# Altium schematic sheet HT_Device.SchDoc
size A3; SheetNumber: 1; SheetTotal: 1
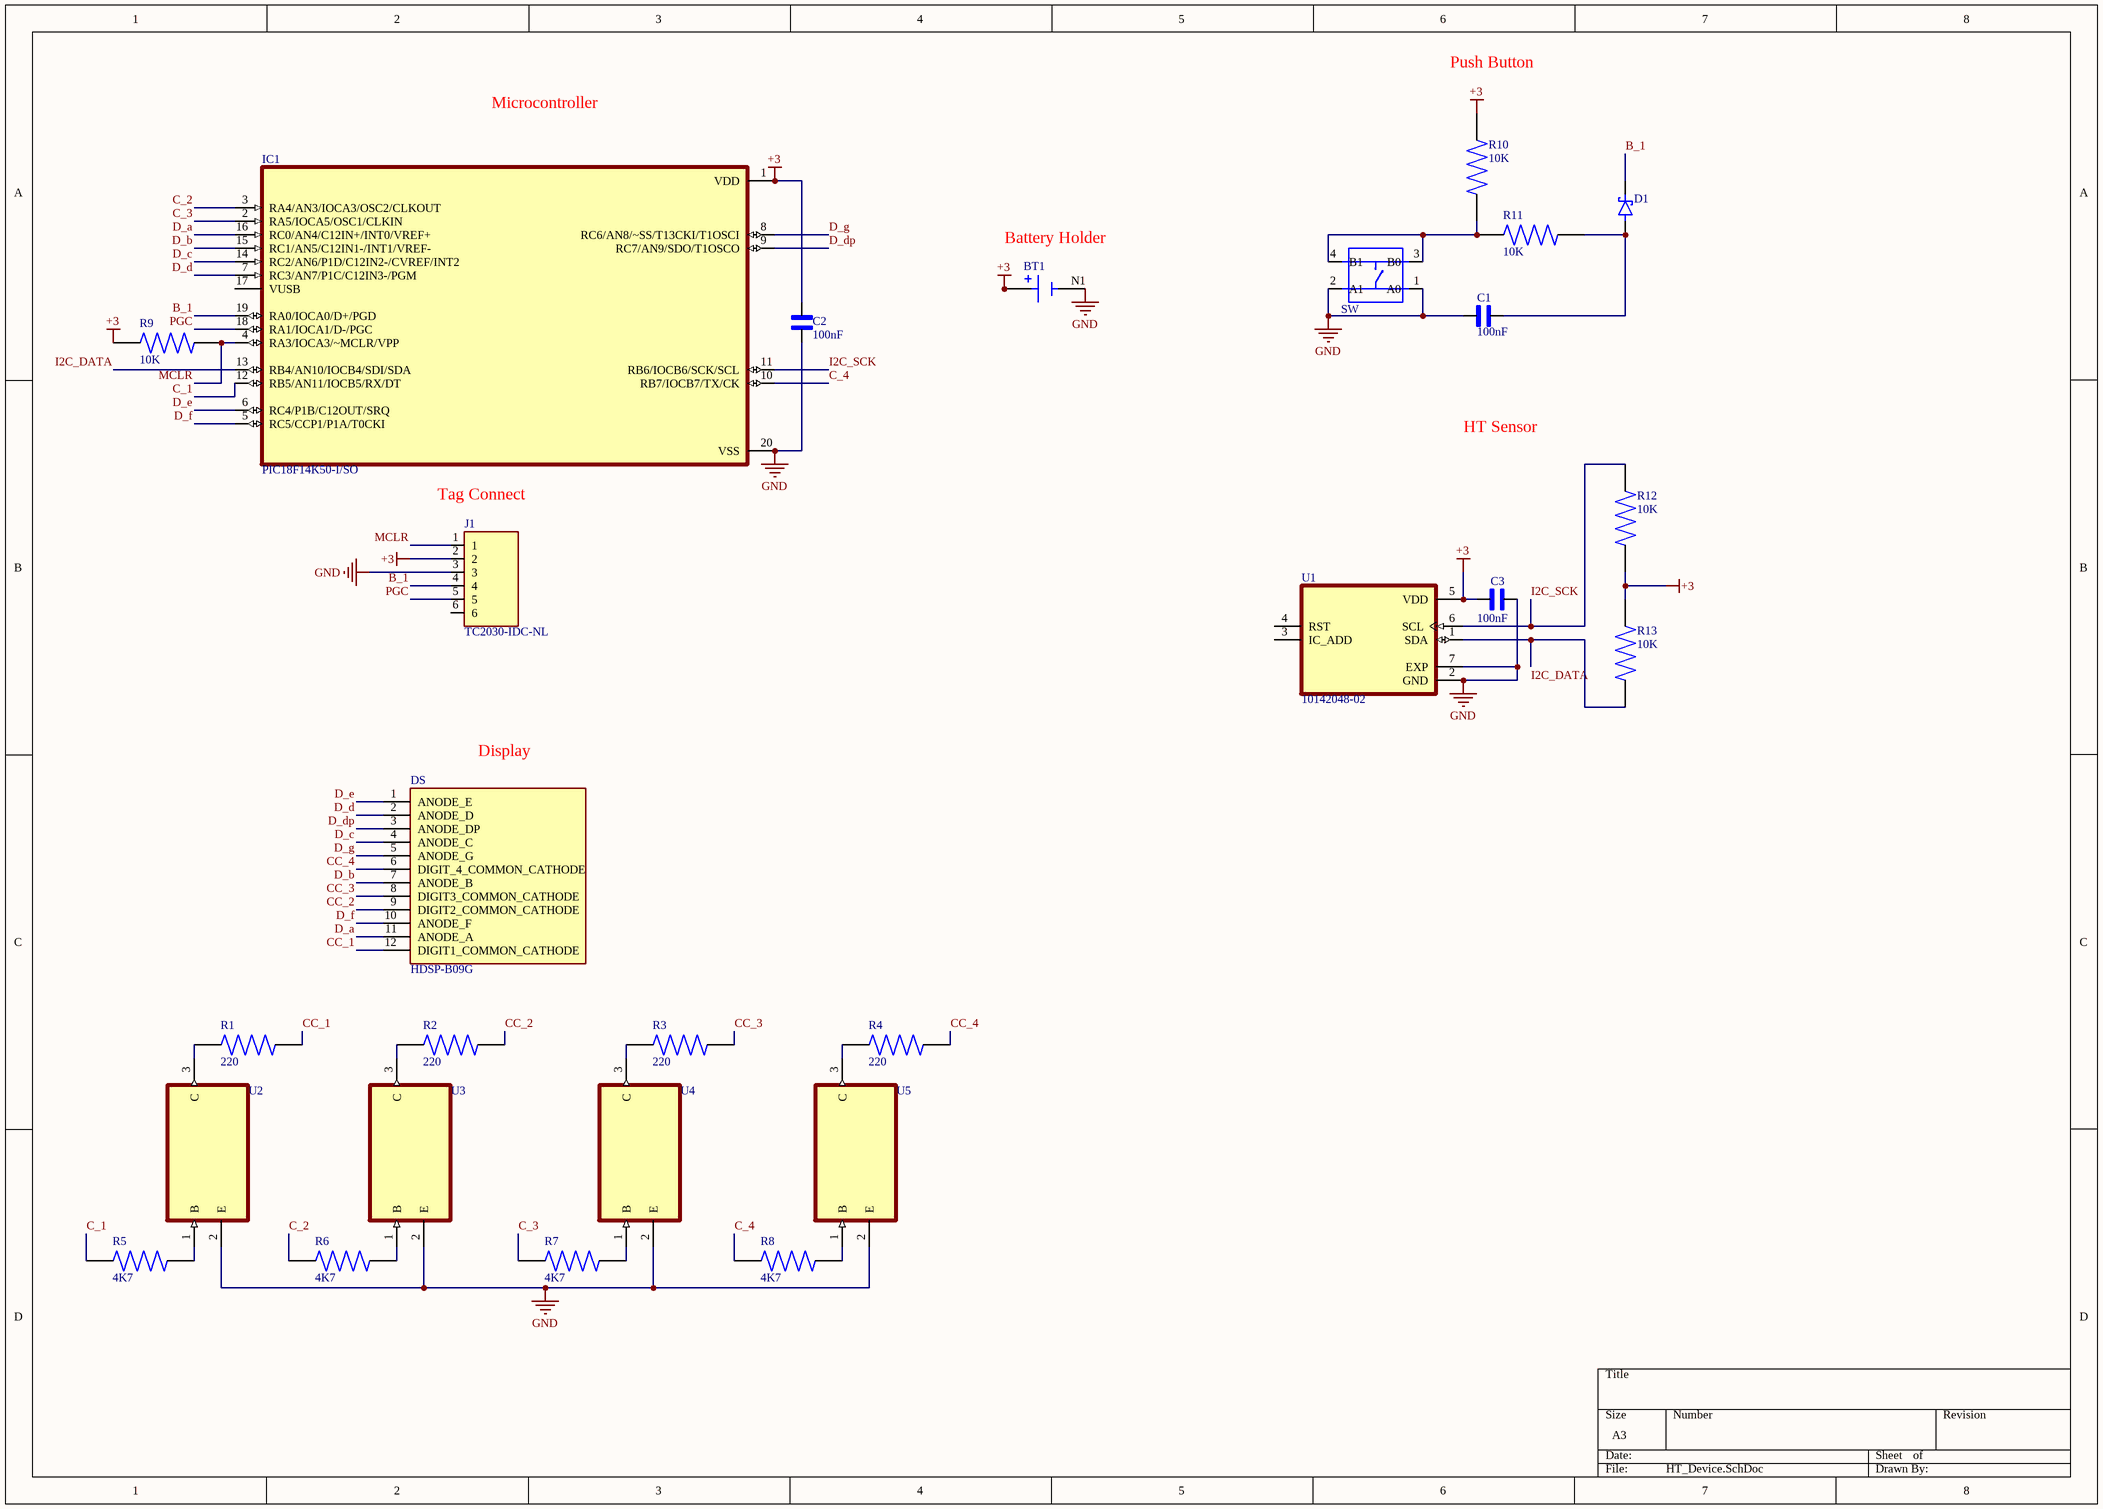
[diagram p0: HT_Device.SchDoc]

## Parts
BT1  BAT-HLD-001  [BAT_BAT-HLD-001]  (value not drawn)
C1  100nF  [WCAP-CSGP_885012207128]
C2  100nF  [WCAP-CSGP_885012207128]
C3  100nF  [WCAP-CSGP_885012207128]
D1  1N5817-T  [DIOAD1039W78L463D236]  (value not drawn)
DS  HDSP-B09G  [AVAGO_HDSP-B09G]
IC1  PIC18F14K50-I/SO  [SOIC127P1032X265-20N]
J1  TC2030-IDC-NL  [TAG_TC2030-IDC-NL]
R1  220  [RES_ERJP06J221V]
R2  220  [RES_ERJP06J221V]
R3  220  [RES_ERJP06J221V]
R4  220  [RES_ERJP06J221V]
R5  4K7  [RESC2012X55N]
R6  4K7  [RESC2012X55N]
R7  4K7  [RESC2012X55N]
R8  4K7  [RESC2012X55N]
R9  10K  [RESC2012X65N]
R10  10K  [RESC2012X65N]
R11  10K  [RESC2012X65N]
R12  10K  [RESC2012X65N]
R13  10K  [RESC2012X65N]
SW  SMD-BUTTON(4P-5.2X5.2X1.5MM-SKQGADE010)  [SW4-SMD-5.2X5.2X1.5MM]  (value not drawn)
U1  10142048-02  [SON80P250X250X100-7N_10142048-02]
U2  MMBT2222A-7-F  [SOT103P240X110-3N]  (value not drawn)
U3  MMBT2222A-7-F  [SOT103P240X110-3N]  (value not drawn)
U4  MMBT2222A-7-F  [SOT103P240X110-3N]  (value not drawn)
U5  MMBT2222A-7-F  [SOT103P240X110-3N]  (value not drawn)

## Nets
+3: BT1.P1(POS) BT1.P2(POS) C2.2 C3.2 IC1.1(VDD) J1.2 R9.1 R10.2 R12.1 R13.2 U1.5(VDD)
GND: BT1.N1(NEG) C1.2 C2.1 C3.1 IC1.20(VSS) J1.3 SW.1(A0) SW.2(A1) U1.2(GND) U1.7(EXP) U2.2(E) U3.2(E) U4.2(E) U5.2(E)
B_1: D1.1(K) IC1.19(RA0/IOCA0/D+/PGD) J1.4
C_1: IC1.12(RB5/AN11/IOCB5/RX/DT) R5.1
C_2: IC1.3(RA4/AN3/IOCA3/OSC2/CLKOUT) R6.1
C_3: IC1.2(RA5/IOCA5/OSC1/CLKIN) R7.1
C_4: IC1.10(RB7/IOCB7/TX/CK) R8.1
CC_1: DS.12(DIGIT1_COMMON_CATHODE) R1.2
CC_2: DS.9(DIGIT2_COMMON_CATHODE) R2.2
CC_3: DS.8(DIGIT3_COMMON_CATHODE) R3.2
CC_4: DS.6(DIGIT_4_COMMON_CATHODE) R4.2
D_a: DS.11(ANODE_A) IC1.16(RC0/AN4/C12IN+/INT0/VREF+)
D_b: DS.7(ANODE_B) IC1.15(RC1/AN5/C12IN1-/INT1/VREF-)
D_c: DS.4(ANODE_C) IC1.14(RC2/AN6/P1D/C12IN2-/CVREF/INT2)
D_d: DS.2(ANODE_D) IC1.7(RC3/AN7/P1C/C12IN3-/PGM)
D_dp: DS.3(ANODE_DP) IC1.9(RC7/AN9/SDO/T1OSCO)
D_e: DS.1(ANODE_E) IC1.6(RC4/P1B/C12OUT/SRQ)
D_f: DS.10(ANODE_F) IC1.5(RC5/CCP1/P1A/T0CKI)
D_g: DS.5(ANODE_G) IC1.8(RC6/AN8/~SS/T13CKI/T1OSCI)
I2C_DATA: IC1.13(RB4/AN10/IOCB4/SDI/SDA) R13.1 U1.1(SDA)
I2C_SCK: IC1.11(RB6/IOCB6/SCK/SCL) R12.2 U1.6(SCL)
MCLR: IC1.4(RA3/IOCA3/~MCLR/VPP) J1.1 R9.2
PGC: IC1.18(RA1/IOCA1/D-/PGC) J1.5
NetC1_1: C1.1 D1.2(A) R11.2
NetR1_1: R1.1 U2.3(C)
NetR2_1: R2.1 U3.3(C)
NetR3_1: R3.1 U4.3(C)
NetR4_1: R4.1 U5.3(C)
NetR5_2: R5.2 U2.1(B)
NetR6_2: R6.2 U3.1(B)
NetR7_2: R7.2 U4.1(B)
NetR8_2: R8.2 U5.1(B)
NetR10_1: R10.1 R11.1 SW.3(B0) SW.4(B1)

Not connected (* = marked no-connect by the designer): IC1 17(VUSB); J1 6; U1 3(IC_ADD) 4(RST)

## Notes on the sheet
- Microcontroller
- Push Button
- (near BT1) Battery Holder
- HT Sensor
- Tag Connect
- Display

## Library data of the parts
BT1 = BAT-HLD-001: Battery Retainer Coin, 20.0mm 1 Cell SMD (SMT) Tab; Value: *; MP: BAT-HLD-001; Package: None; Availability: Unavailable; Price: None
C1-C3 = 885012207128: <b> WCAP-CSGP Ceramic Capacitors <br> <br> <br><b>Characteristics </b><br> </b><br>Multilayer Ceramic Chip Capacitor <br>Recommended soldering:Reflow, for 0603 and 0805 wave soldering is also allowed <br>Operating temperature:-55 Â°C to +125 Â°C; <br>Ceramic characteristics: Class I - NPO ; Class II -X7R, X5R <br>High performance ceramic <br>High capacitance stability <br>Minimal aging  <br>Termination:Cu/Ni/Sn <br>   <br><a href="http://katalog.we-online.de/media/images/eisos/WCAP-CSGP_pf2.jpg" title="Enlarge picture"> <img src="http://katalog.we-online.de/media/thumbs2/eisos/thb_WCAP-CSGP_pf2.jpg" width="320"></a><p> Details see: <a href="http://katalog.we-online.de/en/pbs/WCAP-CSGP-0805?">http://katalog.we-online.de/en/pbs/WCAP-CSGP-0805? </a><p>Created:  2015-01-28 <br>2015 (C) Wurth Elektronik; Package: None; Price: None; Value: *; MP: 885012207128; Availability: Unavailable
D1 = 1N5817-T: Diode Schottky 20 V 1A Through Hole DO-41; MF: Diodes Inc.; Package: DO-41 Diodes Inc.; Price: None; Check_prices: https://www.snapeda.com/parts/1N5817-T/Diodes+Inc./view-part/?ref=eda; Value: *; SnapEDA_Link: https://www.snapeda.com/parts/1N5817-T/Diodes+Inc./view-part/?ref=snap; MP: 1N5817-T; Availability: In Stock; Purchase-URL: https://pricing.snapeda.com/search/part/1N5817-T/?ref=eda
DS = HDSP-B09G: Display Modules - LED Character and Numeric Green 7-Segment Clock 4 Character Common Cathode 2.2V 20mA 0.752 H x 2.016 W x 0.315 D _19.10mm x 51.20mm x 8.00mm_ 12-DIP _0.600, 15.24mm_; MF: Broadcom Limited; Package: DIP-12 Broadcom; MP: HDSP-B09G; Value: *; Availability: Unavailable; SnapEDA_Link: https://www.snapeda.com/parts/HDSP-B09G/Broadcom%20Limited/view-part/1797524/?ref=snap; Price: None
IC1 = PIC18F14K50-I/SO: PIC PICÂ® XLPâ„¢ 18K Microcontroller IC 8-Bit 48MHz 16KB _8K x 16_ FLASH 20-SOIC; MF: Microchip; Price: None; SnapEDA_Link: https://www.snapeda.com/parts/PIC18F14K50-I/SO/Microchip/view-part/39073/?ref=snap; Availability: Unavailable; Value: *; MP: PIC18F14K50-I/SO; Package: SOIC-20 Microchip
J1 = TC2030-IDC-NL: CABLE ADAPTER 6 POS; Value: *; MP: TC2030-IDC-NL; Availability: Unavailable; Package: None; Price: None
R1-R4 = ERJP06J221V: MP: ERJP06J221V; Availability: Unavailable; Package: None; Price: None; Value: *
R5-R8 = TNPW08054K70BXTA: Package: None; Price: None; Value: *; MP: TNPW08054K70BXTA; Availability: Unavailable
R9-R13 = CRG0805F10K: CRG0805 1% 10K; Voltage_Rating: 150 V; MF: TE Connectivity; Power_Rating: .125 W; Resistance: 10K; Price: None; Package: 0805; Value: *; TE_purchase_URL: https://www.te.com/usa-en/product-1623097-1.html?te_bu=Cor&te_type=disp&te_campaign=seda_glo_cor-seda-global-disp-prtnr-fy19-seda-model-bom-cta_sma-317_1&elqCampaignId=32493; SnapEDA_Link: https://www.snapeda.com/parts/CRG0805F10K/TE%20Connectivity%20Passive%20Product/view-part/480372/?ref=snap; Availability: Unavailable; Tolerance: 1%; EU_RoHS_Compliance: Compliant with Exemptions; MP: CRG0805F10K
SW = SMD-BUTTON(4P-5.2X5.2X1.5MM-SKQGADE010): Switch Tactile N.O. SPST Round Button Gull Wing 0.05A 12VDC 2.55N SMD T/R; MF: ALPS; Value: *; Price: None; Package: FakePackage u; SnapEDA_Link: https://www.snapeda.com/parts/SKQGADE010/ALPS/view-part/106172/?ref=snap; Availability: Unavailable; MP: SKQGADE010
U1 = 10142048-02: Digital Relative Humidity sensor with Temperature output; Package: None; Price: None; Value: *; MP: 10142048-02; Availability: Unavailable
U2-U5 = MMBT2222A-7-F: Bipolar _BJT_ Transistor NPN 40V 600mA 300MHz 310mW Surface Mount SOT-23-3; MF: Diodes Inc.; Package: SOT-23-3 Diodes Inc.; Digi-Key_Purchase_URL: https://www.digikey.in/product-detail/en/diodes-incorporated/MMBT2222A-7-F/MMBT2222A-FDICT-ND/815723?utm_source=snapeda&utm_medium=aggregator&utm_campaign=symbol; Value: *; MP: MMBT2222A-7-F; SnapEDA_Link: https://www.snapeda.com/parts/MMBT2222A-7-F/Diodes%20Inc./view-part/229424/?ref=snap; Digi-Key_Part_Number: MMBT2222A-FDICT-ND